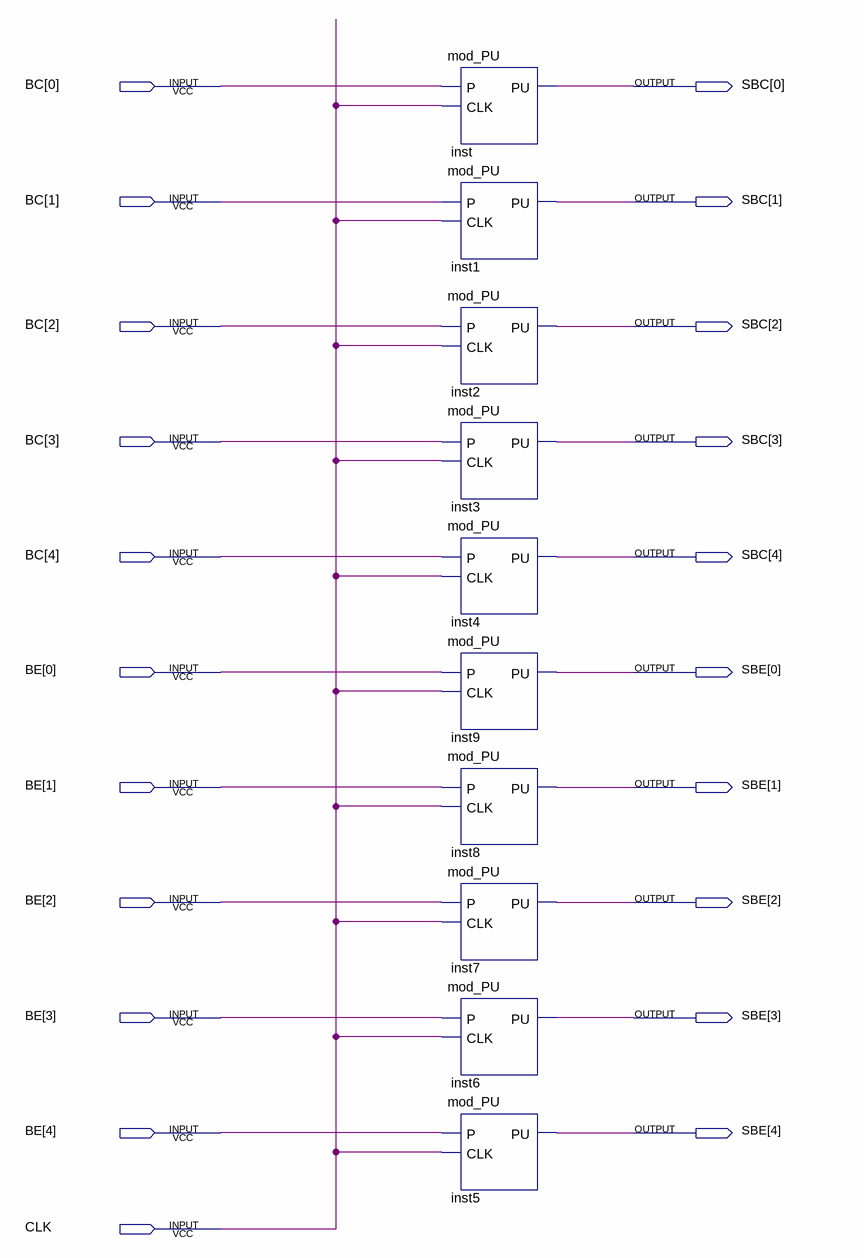
[diagram p0: schematic sheet]
// Quartus schematic Entrada_PulsoUnico.bdf as structural Verilog: 10 symbols, 21 pins
module Entrada_PulsoUnico (
  input  [4:0] BC,
  input  [4:0] BE,
  input  CLK,
  output [4:0] SBC,
  output [4:0] SBE
);

  mod_PU inst (.P(BC[0]), .CLK(CLK), .PU(SBC[0]));
  mod_PU inst1 (.P(BC[1]), .CLK(CLK), .PU(SBC[1]));
  mod_PU inst2 (.P(BC[2]), .CLK(CLK), .PU(SBC[2]));
  mod_PU inst3 (.P(BC[3]), .CLK(CLK), .PU(SBC[3]));
  mod_PU inst4 (.P(BC[4]), .CLK(CLK), .PU(SBC[4]));
  mod_PU inst9 (.P(BE[0]), .CLK(CLK), .PU(SBE[0]));
  mod_PU inst8 (.P(BE[1]), .CLK(CLK), .PU(SBE[1]));
  mod_PU inst7 (.P(BE[2]), .CLK(CLK), .PU(SBE[2]));
  mod_PU inst6 (.P(BE[3]), .CLK(CLK), .PU(SBE[3]));
  mod_PU inst5 (.P(BE[4]), .CLK(CLK), .PU(SBE[4]));
endmodule
